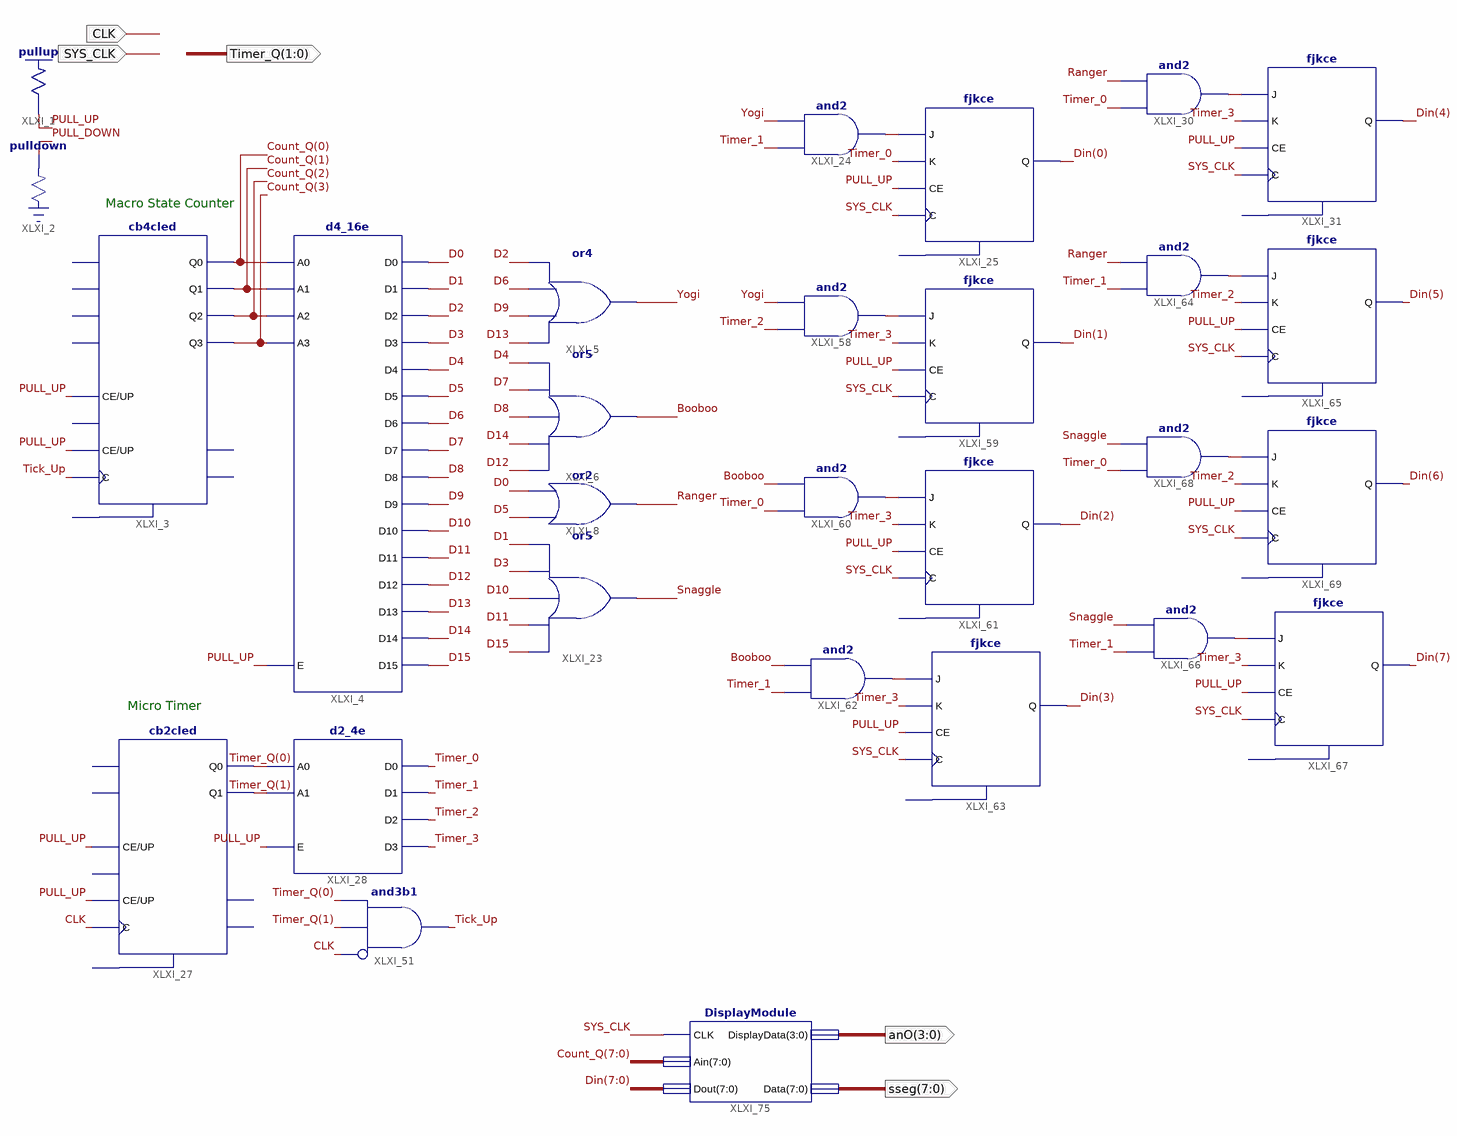
[diagram p0: schematic sheet 1]
// Xilinx ISE schematic Exp4.sch (spartan3e) as structural Verilog: 28 symbols, 5 ports
module Exp4 (
  input  CLK,
  input  SYS_CLK,
  output [1:0] Timer_Q,
  output [3:0] anO,
  output [7:0] sseg
);

  wire Booboo, D0, D1, D2, D3, D4, D5, D6, D7, D8, D9, D10, D11, D12, D13, D14, D15, PULL_DOWN, PULL_UP,
       Ranger, Snaggle, Tick_Up, Timer_0, Timer_1, Timer_2, Timer_3, XLXN_92, XLXN_95, XLXN_181, XLXN_182,
       XLXN_183, XLXN_184, XLXN_185, XLXN_186, Yogi;
  wire [7:0] Count_Q, Din;

  \pullup  XLXI_1 (.O(PULL_UP));
  \pulldown  XLXI_2 (.O(PULL_DOWN));
  cb4cled XLXI_3 (
    .C(Tick_Up), .CE(PULL_UP), .UP(PULL_UP), .Q0(Count_Q[0]), .Q1(Count_Q[1]), .Q2(Count_Q[2]),
    .Q3(Count_Q[3]));  // open: CLR, D0, D1, D2, D3, L, CEO, TC
  d4_16e XLXI_4 (
    .A0(Count_Q[0]), .A1(Count_Q[1]), .A2(Count_Q[2]), .A3(Count_Q[3]), .E(PULL_UP), .D0(D0), .D1(D1),
    .D10(D10), .D11(D11), .D12(D12), .D13(D13), .D14(D14), .D15(D15), .D2(D2), .D3(D3), .D4(D4), .D5(D5),
    .D6(D6), .D7(D7), .D8(D8), .D9(D9));
  or XLXI_5 (Yogi, D13, D9, D6, D2);
  or XLXI_6 (Booboo, D12, D14, D8, D7, D4);
  or XLXI_8 (Ranger, D5, D0);
  or XLXI_23 (Snaggle, D15, D11, D10, D3, D1);
  and XLXI_24 (XLXN_92, Timer_1, Yogi);
  fjkce XLXI_25 (.C(SYS_CLK), .CE(PULL_UP), .J(XLXN_92), .K(Timer_0), .Q(Din[0]));  // open: CLR
  and XLXI_58 (XLXN_181, Timer_2, Yogi);
  fjkce XLXI_59 (.C(SYS_CLK), .CE(PULL_UP), .J(XLXN_181), .K(Timer_3), .Q(Din[1]));  // open: CLR
  and XLXI_60 (XLXN_182, Timer_0, Booboo);
  fjkce XLXI_61 (.C(SYS_CLK), .CE(PULL_UP), .J(XLXN_182), .K(Timer_3), .Q(Din[2]));  // open: CLR
  and XLXI_62 (XLXN_183, Timer_1, Booboo);
  fjkce XLXI_63 (.C(SYS_CLK), .CE(PULL_UP), .J(XLXN_183), .K(Timer_3), .Q(Din[3]));  // open: CLR
  and XLXI_66 (XLXN_185, Timer_1, Snaggle);
  fjkce XLXI_67 (.C(SYS_CLK), .CE(PULL_UP), .J(XLXN_185), .K(Timer_3), .Q(Din[7]));  // open: CLR
  and XLXI_68 (XLXN_186, Timer_0, Snaggle);
  and XLXI_64 (XLXN_184, Timer_1, Ranger);
  fjkce XLXI_69 (.C(SYS_CLK), .CE(PULL_UP), .J(XLXN_186), .K(Timer_2), .Q(Din[6]));  // open: CLR
  fjkce XLXI_65 (.C(SYS_CLK), .CE(PULL_UP), .J(XLXN_184), .K(Timer_2), .Q(Din[5]));  // open: CLR
  fjkce XLXI_31 (.C(SYS_CLK), .CE(PULL_UP), .J(XLXN_95), .K(Timer_3), .Q(Din[4]));  // open: CLR
  and XLXI_30 (XLXN_95, Timer_0, Ranger);
  cb2cled XLXI_27 (
    .C(CLK), .CE(PULL_UP), .UP(PULL_UP), .Q0(Timer_Q[0]), .Q1(Timer_Q[1]));  // open: CLR, D0, D1, L, CEO, TC
  d2_4e XLXI_28 (.A0(Timer_Q[0]), .A1(Timer_Q[1]), .E(PULL_UP), .D0(Timer_0), .D1(Timer_1), .D2(Timer_2), .D3(Timer_3));
  and XLXI_51 (Tick_Up, ~CLK, Timer_Q[1], Timer_Q[0]);  // and3b1
  DisplayModule XLXI_75 (.CLK(SYS_CLK), .Ain(Count_Q), .Dout(Din), .DisplayData(anO), .Data(sseg));

  // Notes on the sheet:
  //   Macro State Counter
  //   Micro Timer
endmodule
